# Altium schematic sheet Connecteurs.SchDoc
size A4
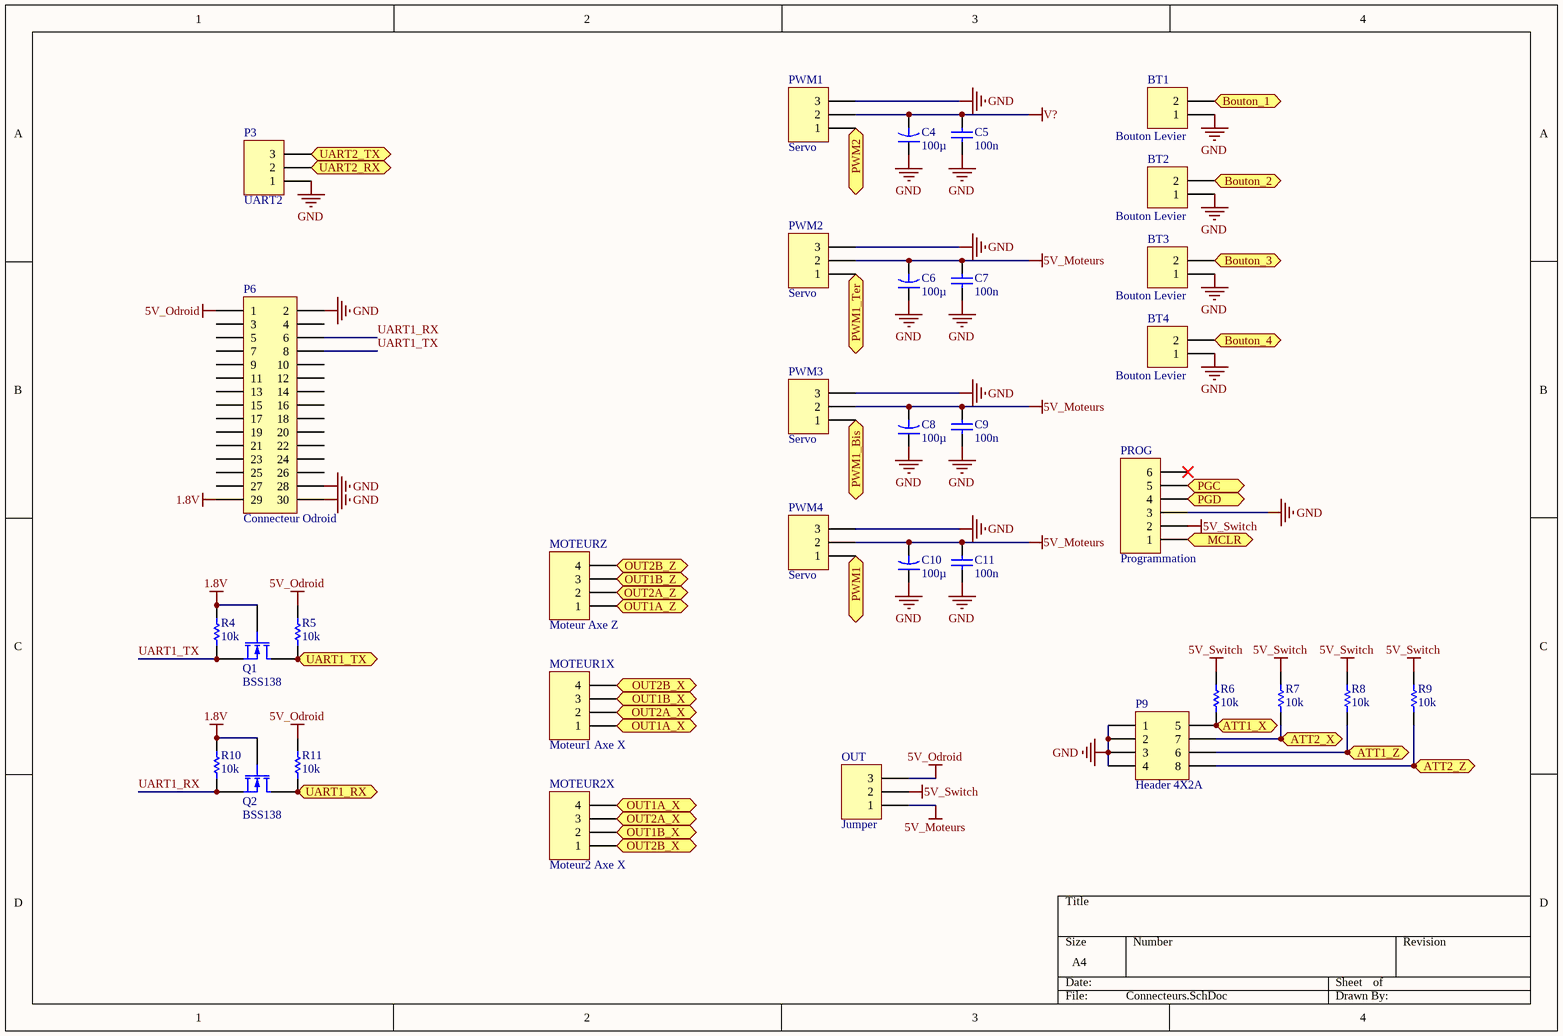
[diagram p0: Connecteurs.SchDoc]

## Parts
BT1  Bouton Levier  [HDR1X2]
BT2  Bouton Levier  [HDR1X2]
BT3  Bouton Levier  [HDR1X2]
BT4  Bouton Levier  [HDR1X2]
C4  value 100µ  [CAPR5-4X5]  (hidden comment: Cap2)
C5  value 100n  [0805]  (hidden comment: Cap)
C6  value 100µ  [CAPR5-4X5]  (hidden comment: Cap2)
C7  value 100n  [0805]  (hidden comment: Cap)
C8  value 100µ  [CAPR5-4X5]  (hidden comment: Cap2)
C9  value 100n  [0805]  (hidden comment: Cap)
C10  value 100µ  [CAPR5-4X5]  (hidden comment: Cap2)
C11  value 100n  [0805]  (hidden comment: Cap)
MOTEUR1X  Moteur1 Axe X  [HDR1X4]
MOTEUR2X  Moteur2 Axe X  [HDR1X4]
MOTEURZ  Moteur Axe Z  [HDR1X4]
OUT  Jumper  [HDR1X3]
P3  UART2  [HDR1X3]
P6  Connecteur Odroid  [HDR2X15]
P9  Header 4X2A  [Interrupteur coulissant]
PROG  Programmation  [690367280676]
PWM1  Servo  [HDR1X3]
PWM2  Servo  [HDR1X3]
PWM3  Servo  [HDR1X3]
PWM4  Servo  [HDR1X3]
Q1  BSS138  [SOT23-3_N]
Q2  BSS138  [SOT23-3_N]
R4  value 10k  [0805]  (hidden comment: Res*)
R5  value 10k  [0805]  (hidden comment: Res*)
R6  value 10k  [0805]  (hidden comment: Res*)
R7  value 10k  [0805]  (hidden comment: Res*)
R8  value 10k  [0805]  (hidden comment: Res*)
R9  value 10k  [0805]  (hidden comment: Res*)
R10  value 10k  [0805]  (hidden comment: Res*)
R11  value 10k  [0805]  (hidden comment: Res*)

## Ports
ATT1_X, ATT1_Z, ATT2_X, ATT2_Z, Bouton_1, Bouton_2, Bouton_3, Bouton_4, MCLR, OUT1A_X, OUT1A_Z, OUT1B_X, OUT1B_Z, OUT2A_X, OUT2A_Z, OUT2B_X, OUT2B_Z, PGC, PGD, PWM1, PWM1_Bis, PWM1_Ter, PWM2, UART1_RX, UART1_TX, UART2_RX, UART2_TX

## Nets
1.8V: P6.29 Q1.2(G) Q2.2(G) R4.1 R10.1
5V_Moteurs: C6.2 C7.1 C8.2 C9.1 C10.2 C11.1 OUT.1 PWM2.2 PWM3.2 PWM4.2
5V_Odroid: OUT.3 P6.1 R5.1 R11.1
5V_Switch: OUT.2 PROG.2 R6.1 R7.1 R8.1 R9.1
GND: BT1.1 BT2.1 BT3.1 BT4.1 C4.1 C5.2 C6.1 C7.2 C8.1 C9.2 C10.1 C11.2 P3.1 P6.2 P6.28 P6.30 P9.1 P9.2 P9.3 P9.4 PROG.3 PWM1.3 PWM2.3 PWM3.3 PWM4.3
V?: C4.2 C5.1 PWM1.2
ATT1_X: P9.5 R6.2 ; port ATT1_X
ATT1_Z: P9.6 R8.2 ; port ATT1_Z
ATT2_X: P9.7 R7.2 ; port ATT2_X
ATT2_Z: P9.8 R9.2 ; port ATT2_Z
Bouton_1: BT1.2 ; port Bouton_1
Bouton_2: BT2.2 ; port Bouton_2
Bouton_3: BT3.2 ; port Bouton_3
Bouton_4: BT4.2 ; port Bouton_4
MCLR: PROG.1 ; port MCLR
OUT1A_X: MOTEUR1X.1 MOTEUR2X.4 ; port OUT1A_X
OUT1A_Z: MOTEURZ.1 ; port OUT1A_Z
OUT1B_X: MOTEUR1X.3 MOTEUR2X.2 ; port OUT1B_X
OUT1B_Z: MOTEURZ.3 ; port OUT1B_Z
OUT2A_X: MOTEUR1X.2 MOTEUR2X.3 ; port OUT2A_X
OUT2A_Z: MOTEURZ.2 ; port OUT2A_Z
OUT2B_X: MOTEUR1X.4 MOTEUR2X.1 ; port OUT2B_X
OUT2B_Z: MOTEURZ.4 ; port OUT2B_Z
PGC: PROG.5 ; port PGC
PGD: PROG.4 ; port PGD
PWM1: PWM4.1 ; port PWM1
PWM1_Bis: PWM3.1 ; port PWM1_Bis
PWM1_Ter: PWM2.1 ; port PWM1_Ter
PWM2: PWM1.1 ; port PWM2
UART1_RX: P6.6 Q2.3(S) R10.2
UART1_RX: Q2.1(D) R11.2 ; port UART1_RX  [a separate net that carries the same name]
UART1_TX: Q1.1(D) R5.2 ; port UART1_TX
UART1_TX: P6.8 Q1.3(S) R4.2  [a separate net that carries the same name]
UART2_RX: P3.2 ; port UART2_RX
UART2_TX: P3.3 ; port UART2_TX

Not connected (* = marked no-connect by the designer): P6 3 4 5 7 9 10 11 12 13 14 15 16 17 18 19 20 21 22 23 24 25 26 27; PROG 6*

## Library data of the parts
BT1-BT4 = Header 2: Header, 2-Pin; LatestRevisionDate: 17-Jul-2002; LatestRevisionNote: Re-released for DXP Platform.; Publisher: Altium Limited
C4 C6 C8 C10 = Cap2: 100µ; Published: 23-Sep-2002; PackageReference: CAPR5-4X5; Publisher: Altium Limited
C5 C7 C9 C11 = Cap: 100n; Published: 8-Jun-2000; LatestRevisionDate: 17-Jul-2002; LatestRevisionNote: Re-released for DXP Platform.; PackageReference: RAD-0.3; Publisher: Altium Limited
MOTEUR1X MOTEUR2X MOTEURZ = Header 4: Header, 4-Pin; LatestRevisionDate: 17-Jul-2002; LatestRevisionNote: Re-released for DXP Platform.; Publisher: Altium Limited
OUT P3 PWM1-PWM4 = Header 3: Header, 3-Pin; LatestRevisionDate: 17-Jul-2002; LatestRevisionNote: Re-released for DXP Platform.; Publisher: Altium Limited
P6 = Header 15X2: Header, 15-Pin, Dual row; LatestRevisionDate: 17-Jul-2002; LatestRevisionNote: Re-released for DXP Platform.; Publisher: Altium Limited
P9 = Header 4X2A: Header, 4-Pin, Dual row; LatestRevisionDate: 17-Jul-2002; LatestRevisionNote: Re-released for DXP Platform.; Publisher: Altium Limited
PROG = Header 6: Header, 6-Pin; LatestRevisionDate: 17-Jul-2002; LatestRevisionNote: Re-released for DXP Platform.; Publisher: Altium Limited
Q1 Q2 = MOSFET-N: N-Channel MOSFET; Published: 8-Jun-2000; LatestRevisionDate: 17-Jul-2002; LatestRevisionNote: Re-released for DXP Platform.; PackageVersion: 1995/1996; PackageReference: E3; Publisher: Altium Limited; PackageDescription: TO, Flat Index; 3 In-Line, Axial Leads; Body Dia. 4.6mm; Lead Dia. 0.5 mm (max)
R4-R11 = Res1: 10k; Published: 8-Jun-2000; LatestRevisionDate: 17-Jul-2002; LatestRevisionNote: Re-released for DXP Platform.; PackageReference: AXIAL-0.3; Publisher: Altium Limited